# Altium project ST Linux Dev Board.PrjPcb
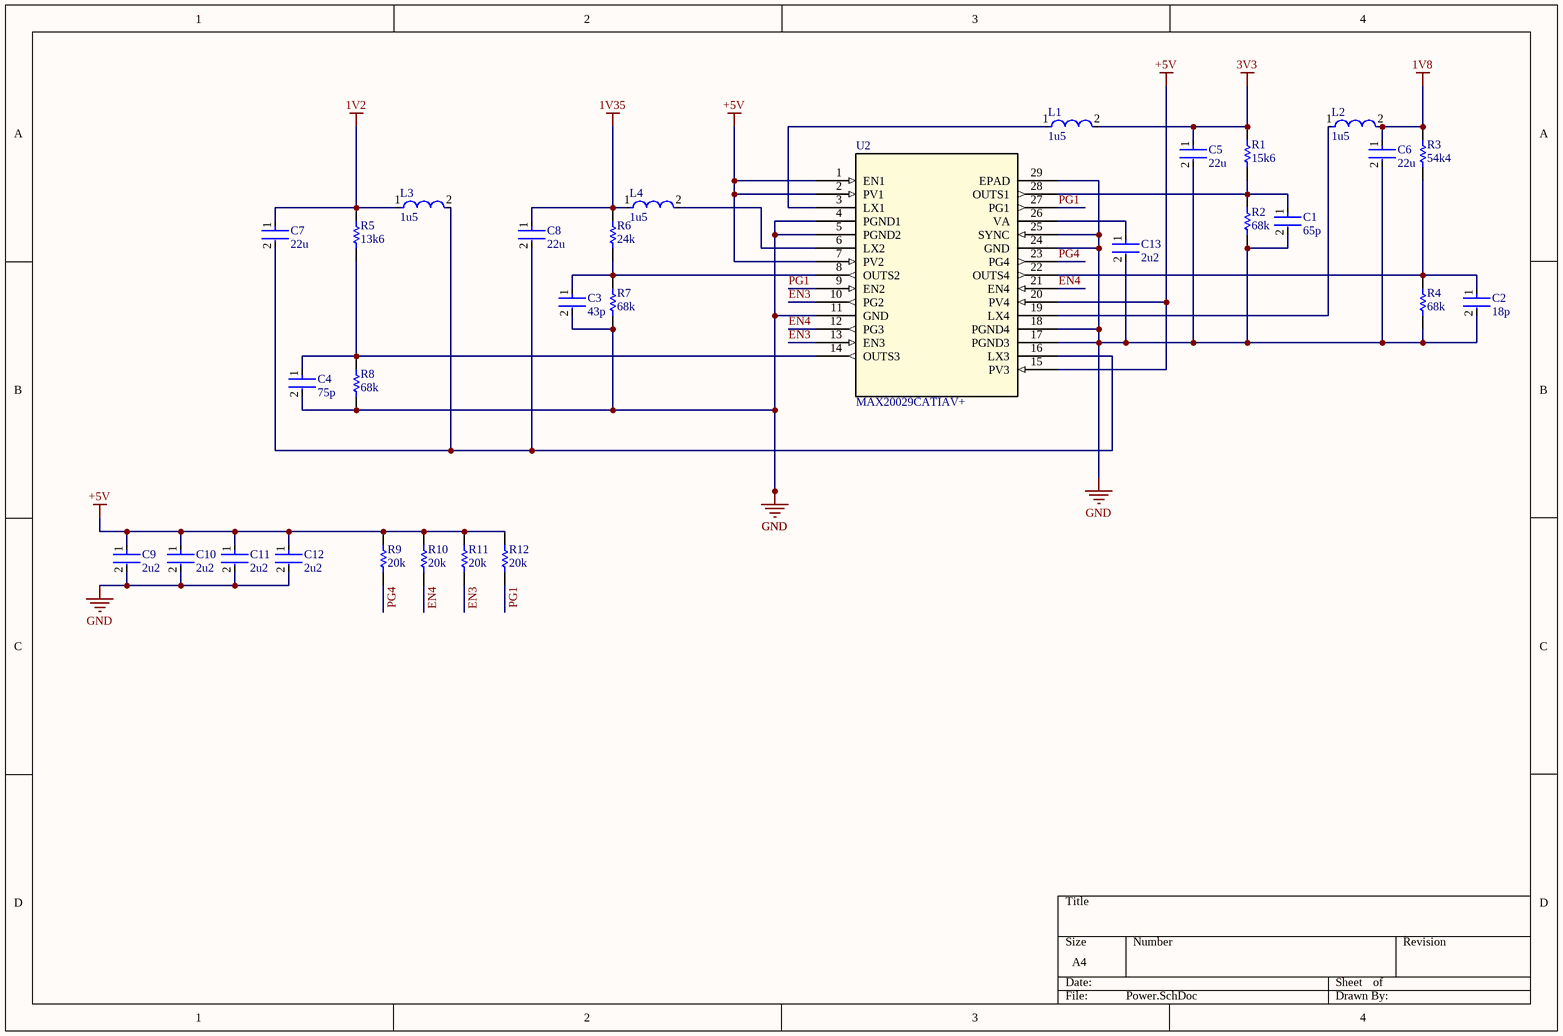
[diagram p0: Power.SchDoc]
7 sheets, 170 parts. Net scope: global (net labels, ports and power ports of the same name join across sheets).
Board file: PCB1.PcbDoc
Sheets:
  Power.SchDoc
  DDR3.SchDoc
  STM32 VDD VSS.SchDoc
  STM32 Decoupling.SchDoc
  MicroSD.SchDoc
  eMMC.SchDoc
  Ethernet.SchDoc

## Sheet Power.SchDoc
size A4; SheetNumber: 1; SheetTotal: 4

### Parts
C1  65p  [FP-C0603C-CF-MFG]
C2  18p  [FP-C0603C-CF-MFG]
C3  43p  [FP-C0603C-CF-MFG]
C4  75p  [FP-C0603C-CF-MFG]
C5  22u  [FP-CC0805-0_85-MFG]
C6  22u  [FP-CC0805-0_85-MFG]
C7  22u  [FP-CC0805-0_85-MFG]
C8  22u  [FP-CC0805-0_85-MFG]
C9  2u2  [FP-CC0805-0_85-MFG]
C10  2u2  [FP-CC0805-0_85-MFG]
C11  2u2  [FP-CC0805-0_85-MFG]
C12  2u2  [FP-CC0805-0_85-MFG]
C13  2u2  [FP-CC0805-0_85-MFG]
L1  1u5  [FP-LQM2HPN_G0-IPC_A]
L2  1u5  [FP-LQM2HPN_G0-IPC_A]
L3  1u5  [FP-LQM2HPN_G0-IPC_A]
L4  1u5  [FP-LQM2HPN_G0-IPC_A]
R1  15k6  [RESC1609X50X30NL8T20]
R2  68k  [RESC1609X50X30NL8T20]
R3  54k4  [RESC1609X50X30NL8T20]
R4  68k  [RESC1609X50X30NL8T20]
R5  13k6  [RESC1609X50X30NL8T20]
R6  24k  [RESC1609X50X30NL8T20]
R7  68k  [RESC1609X50X30NL8T20]
R8  68k  [RESC1609X50X30NL8T20]
R9  20k  [RESC1609X50X30NL8T20]
R10  20k  [RESC1609X50X30NL8T20]
R11  20k  [RESC1609X50X30NL8T20]
R12  20k  [RESC1609X50X30NL8T20]
U2  MAX20029CATIAV+  [QUADBUCK QFN28]

### Nets
1V2: C7.1 L3.1 R5.1
1V8: C6.1 L2.2 R3.1
1V35: C8.1 L4.1 R6.1
3V3: C5.1 L1.2 R1.1
+5V: C9.1 C10.1 C11.1 C12.1 R9.1 R10.1 R11.1 R12.1 U2.1(EN1) U2.2(PV1) U2.7(PV2) U2.15(PV3) U2.20(PV4)
GND: C1.2 C2.2 C3.2 C4.2 C5.2 C6.2 C9.2 C10.2 C11.2 C12.2 C13.2 R2.2 R4.2 R7.2 R8.2 U2.4(PGND1) U2.5(PGND2) U2.11(GND) U2.17(PGND3) U2.18(PGND4) U2.24(GND) U2.25(SYNC) U2.29(EPAD)
EN3: R11.2 U2.10(PG2) U2.13(EN3)
EN4: R10.2 U2.12(PG3) U2.21(EN4)
PG1: R12.2 U2.9(EN2) U2.27(PG1)
PG4: R9.2 U2.23(PG4)
NetC1_1: C1.1 R1.2 R2.1 U2.28(OUTS1)
NetC2_1: C2.1 R3.2 R4.1 U2.22(OUTS4)
NetC3_1: C3.1 R6.2 R7.1 U2.8(OUTS2)
NetC4_1: C4.1 R5.2 R8.1 U2.14(OUTS3)
NetC7_2: C7.2 C8.2 L3.2 U2.16(LX3)
NetC13_1: C13.1 U2.26(VA)
NetL1_1: L1.1 U2.3(LX1)
NetL2_1: L2.1 U2.19(LX4)
NetL4_2: L4.2 U2.6(LX2)

### Library data of the parts
C1-C4 = CMP-2006-03061-2: CAP CER 0.1UF 50V X7R 0603; Manufacturer: KEMET; Manufacturer Part Number: C0603C104K5RACTU; Tolerance: 0.1; Temperature Coefficient: 30ppm/°C; Material: Ceramic; Automotive Grade: Grade 1; Value: 0.10 μF; Temperature: -55°C to +125°C; RoHS: TRUE; Temperature Range High: +125°C; Lead Free: Yes; Octopart: https://octopart.com/c0603c104k5ractu-kemet-139244; Digikey Description: CAP CER 0.1UF 50V X7R 0603; Category: Cap; Package: C0603C-CF; ComponentLink2Description: Datasheet; Temperature Range Low: -55°C; Device Class L1: Passive Components; Voltage Rating: 50 V; Automotive: Yes; Device Class L3: Ceramic Capacitors; ComponentLink2URL: https://api.kemet.com/component-edge/download/datasheet/C0603C100J5GACAUTO.pdf; Capacitance: 0.10 μF; Device Class L2: Capacitors; Temperature Characteristic: X7R; Height: 0.87mm
C5-C13 = CMP-2100-03606-3: CAP CER 0.1UF 50V X7R 0805; Manufacturer Part Number: CC0805KRX7R9BB104; Manufacturer: Yageo; Tolerance: 0.1; Capacitance: 100 nF; Value: 100 nF; Description: CC0805 100 nF X7R 10.00% 50 V; Material: Ceramic; Device Class L1: Passive Components; ComponentLink2Description: Datasheet; Package: CC0805-0.85; Digikey Description: CAP CER 0.1UF 50V X7R 0805; Device Class L3: Ceramic Capacitors; Temperature: -30°C to +85°C; Temperature Characteristic: X7R; Voltage Rating: 50 V; Height: 0.95mm; RoHS: TRUE; Ipc Land Pattern Name: CAPC200125X85; Device Class L2: Capacitors; Category: Cap; Temperature Range Low: -30°C; Temperature Range High: +85°C; Mouser Description: Multilayer Ceramic Capacitors MLCC - SMD/SMT 100nF 50V X7R 10%; Footprint Url: http://www.yageo.com/exep/pages/download/literatures/UPY-C_GEN_24.pdf; Automotive: No; Octopart: https://octopart.com/cc0805krx7r9bb104-yageo-192993; Lead Free: Yes; ComponentLink2URL: http://www.yageo.com/documents/recent/UPY-GPHC_Y5V_6.3V-to-50V_8.pdf
L1-L4 = CMP-06042-016283-1: FIXED IND 1UH 1.6A 55 MOHM SMD; Shielding: Shielded; Tolerance: 20%; Test Frequency: 1MHz; Self Resonant Frequency: 60MHz; Core Material: Ferrite; DC Resistance (DCR): 69mR; Width: 2mm; Length: 2.5mm; Mount: Surface Mount; Packaging: Tape and Reel; Depth: 2.2mm; Height: 1.2mm; Termination: SMD/SMT; Case Code (Metric): 2520; Current Rating: 1.6A; Package Quantity: 3000; Min Operating Temperature: -55°C; Inductance Tolerance: 20%; RoHS Compliant: Yes; Radiation Hardening: No; REACH SVHC: No SVHC; Rated Current-Max: 1.6A; Inductance: 1uH; Series: LQM2HP_G0; Max DC Current: 1.6A; Case Code (Imperial): 1008; Max Operating Temperature: 125°C; DC Current: 1.6A; Military Standard: Not; Case/Package: 1008; Lead Free: Lead Free; Height - Seated (Max): 0.039inch
R1-R12 = CMP-1666-00005-4: Chip Resistor, 10 KOhm, +/- 1%, 100 mW, -55 to 155 degC, 0603 (1608 Metric), RoHS, Tape and Reel; Manufacturer: Vishay Semiconductor; Voltage Rating: 75 V; Max Operating Temperature: 155 degC; PackageDescription: 2-Pin Surface Mount Device, Body 1.575 x 0.85 mm; ComponentLink1Description: Manufacturer URL; RoHSCompliant: true; PackageReference: 0603; REACH SVHC: Unknown; Length: 1.55 mm; DatasheetVersion: 06/2012; Packaging: Tape and Reel; Min Operating Temperature: -55 degC; Mounting Technology: Surface Mount; ComponentLink2URL: https://datasheet.ciiva.com/11809/0900766b80d98afc-11809037.pdf; Height: 0.45 mm; ComponentLink2Description: Datasheet; Package Quantity: 5000; ComponentLink1URL: http://www.vishay.com/
U2 = MAX20029CATIAV+: No Description Available; Mfr_Name: Analog Devices / Maxim Integrated; RefDes: RefDes; Type: Type

## Sheet DDR3.SchDoc
size A4; SheetNumber: 2; SheetTotal: 7
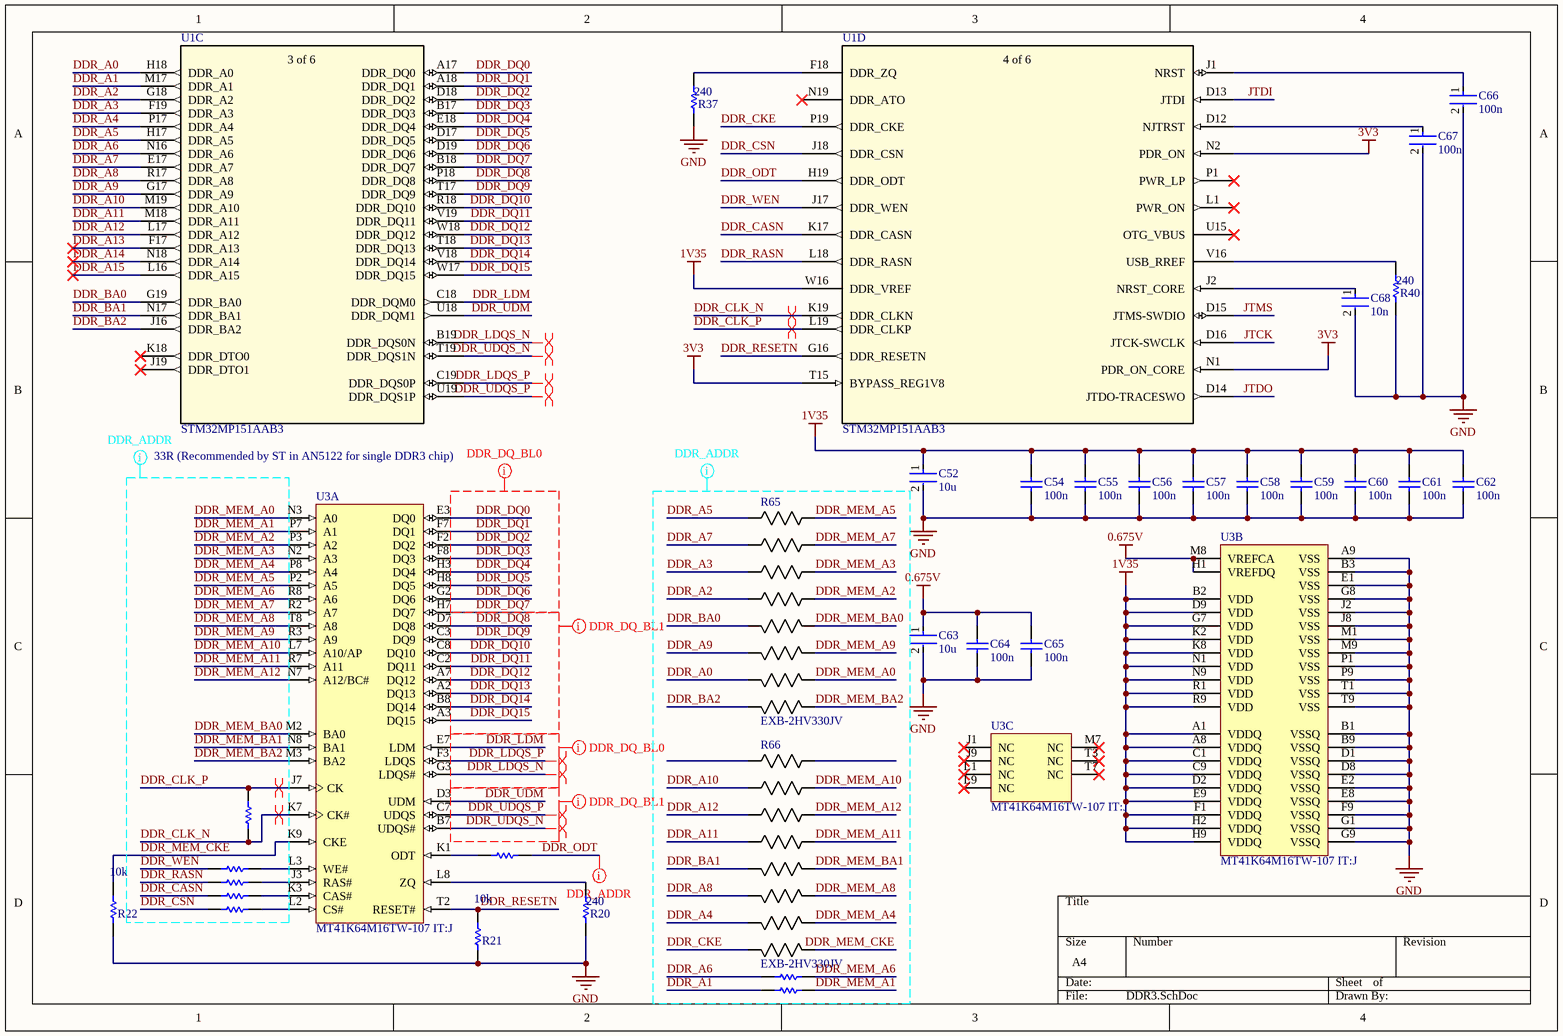
[diagram p1: DDR3.SchDoc]

### Parts
C52  10u  [FP-CC0805-0_85-MFG]
C54  100n  [CAPC0603X33X15LL03T05]
C55  100n  [CAPC0603X33X15LL03T05]
C56  100n  [CAPC0603X33X15LL03T05]
C57  100n  [CAPC0603X33X15LL03T05]
C58  100n  [CAPC0603X33X15LL03T05]
C59  100n  [CAPC0603X33X15LL03T05]
C60  100n  [CAPC0603X33X15LL03T05]
C61  100n  [CAPC0603X33X15LL03T05]
C62  100n  [CAPC0603X33X15LL03T05]
C63  10u  [FP-CC0805-0_85-MFG]
C64  100n  [CAPC0603X33X15LL03T05]
C65  100n  [CAPC0603X33X15LL03T05]
C66  100n  [FP-C0603C-CF-MFG]
C67  100n  [FP-C0603C-CF-MFG]
C68  10n  [FP-C0603C-CF-MFG]
R13  CRCW0201100RFKED  [RESC0603X28X15ML05T05]  (value not drawn)
R14  CRCW0201100RFKED  [RESC0603X28X15ML05T05]  (value not drawn)
R15  CRCW0201100RFKED  [RESC0603X28X15ML05T05]  (value not drawn)
R16  CRCW0201100RFKED  [RESC0603X28X15ML05T05]  (value not drawn)
R17  CRCW0201100RFKED  [RESC0603X28X15ML05T05]  (value not drawn)
R18  CRCW0201100RFKED  [RESC0603X28X15ML05T05]  (value not drawn)
R19  CRCW0201100RFKED  [RESC0603X28X15ML05T05]  (value not drawn)
R20  240  [RESC1609X50X30NL8T20]
R21  10k  [RESC0603X28X15ML05T05]
R22  10k  [RESC0603X28X15ML05T05]
R29  CRCW0201100RFKED  [RESC0603X28X15ML05T05]  (value not drawn)
R37  240  [RESC1609X50X30NL8T20]
R40  240  [RESC1609X50X30NL8T20]
R65  EXB-2HV330JV  [RES_EXB2HV]
R66  EXB-2HV330JV  [RES_EXB2HV]
U1  STM32MP151AAB3  [LFBGA354_16X16_STM]  (parts C,D of 6)
U3  MT41K64M16TW-107 IT:J  [MICT-TW-96]  (parts A,B,C of 3)

### Nets
0.675V: C63.1 C64.2 C65.2 U3.H1(VREFDQ) U3.M8(VREFCA)
1V35: C52.1 C54.2 C55.2 C56.2 C57.2 C58.2 C59.2 C60.2 C61.2 C62.2 U1.W16(DDR_VREF) U3.A1(VDDQ) U3.A8(VDDQ) U3.B2(VDD) U3.C1(VDDQ) U3.C9(VDDQ) U3.D2(VDDQ) U3.D9(VDD) U3.E9(VDDQ) U3.F1(VDDQ) U3.G7(VDD) U3.H2(VDDQ) U3.H9(VDDQ) U3.K2(VDD) U3.K8(VDD) U3.N1(VDD) U3.N9(VDD) U3.R1(VDD) U3.R9(VDD)
3V3: U1.N1(PDR_ON_CORE) U1.N2(PDR_ON) U1.T15(BYPASS_REG1V8)
GND: C52.2 C54.1 C55.1 C56.1 C57.1 C58.1 C59.1 C60.1 C61.1 C62.1 C63.2 C64.1 C65.1 C66.2 C67.2 C68.2 R20.1 R21.1 R22.1 R37.1 R40.1 U3.A9(VSS) U3.B1(VSSQ) U3.B3(VSS) U3.B9(VSSQ) U3.D1(VSSQ) U3.D8(VSSQ) U3.E1(VSS) U3.E2(VSSQ) U3.E8(VSSQ) U3.F9(VSSQ) U3.G1(VSSQ) U3.G8(VSS) U3.G9(VSSQ) U3.J2(VSS) U3.J8(VSS) U3.M1(VSS) U3.M9(VSS) U3.P1(VSS) U3.P9(VSS) U3.T1(VSS) U3.T9(VSS)
DDR_A0: R65.7 U1.H18(DDR_A0)
DDR_A1: R19.1 U1.M17(DDR_A1)
DDR_A2: R65.4 U1.G18(DDR_A2)
DDR_A3: R65.3 U1.F19(DDR_A3)
DDR_A4: R66.7 U1.P17(DDR_A4)
DDR_A5: R65.1 U1.H17(DDR_A5)
DDR_A6: R18.1 U1.N16(DDR_A6)
DDR_A7: R65.2 U1.E17(DDR_A7)
DDR_A8: R66.6 U1.R17(DDR_A8)
DDR_A9: R65.6 U1.G17(DDR_A9)
DDR_A10: R66.2 U1.M19(DDR_A10)
DDR_A11: R66.4 U1.M18(DDR_A11)
DDR_A12: R66.3 U1.L17(DDR_A12)
DDR_A13: U1.F17(DDR_A13)
DDR_A14: U1.N18(DDR_A14)
DDR_A15: U1.L16(DDR_A15)
DDR_BA0: R65.5 U1.G19(DDR_BA0)
DDR_BA1: R66.5 U1.N17(DDR_BA1)
DDR_BA2: R65.8 U1.J16(DDR_BA2)
DDR_CASN: R16.1 U1.K17(DDR_CASN)
DDR_CKE: R66.8 U1.P19(DDR_CKE)
DDR_CLK_N: R29.1 U1.K19(DDR_CLKN) U3.K7(CK#)
DDR_CLK_P: R29.2 U1.L19(DDR_CLKP) U3.J7(CK)
DDR_CSN: R17.1 U1.J18(DDR_CSN)
DDR_DQ0: U1.A17(DDR_DQ0) U3.E3(DQ0)
DDR_DQ1: U1.A18(DDR_DQ1) U3.F7(DQ1)
DDR_DQ2: U1.D18(DDR_DQ2) U3.F2(DQ2)
DDR_DQ3: U1.B17(DDR_DQ3) U3.F8(DQ3)
DDR_DQ4: U1.E18(DDR_DQ4) U3.H3(DQ4)
DDR_DQ5: U1.D17(DDR_DQ5) U3.H8(DQ5)
DDR_DQ6: U1.D19(DDR_DQ6) U3.G2(DQ6)
DDR_DQ7: U1.B18(DDR_DQ7) U3.H7(DQ7)
DDR_DQ8: U1.P18(DDR_DQ8) U3.D7(DQ8)
DDR_DQ9: U1.T17(DDR_DQ9) U3.C3(DQ9)
DDR_DQ10: U1.R18(DDR_DQ10) U3.C8(DQ10)
DDR_DQ11: U1.V19(DDR_DQ11) U3.C2(DQ11)
DDR_DQ12: U1.W18(DDR_DQ12) U3.A7(DQ12)
DDR_DQ13: U1.T18(DDR_DQ13) U3.A2(DQ13)
DDR_DQ14: U1.V18(DDR_DQ14) U3.B8(DQ14)
DDR_DQ15: U1.W17(DDR_DQ15) U3.A3(DQ15)
DDR_LDM: U1.C18(DDR_DQM0) U3.E7(LDM)
DDR_LDQS_N: U1.B19(DDR_DQS0N) U3.G3(LDQS#)
DDR_LDQS_P: U1.C19(DDR_DQS0P) U3.F3(LDQS)
DDR_MEM_A0: R65.10 U3.N3(A0)
DDR_MEM_A1: R19.2 U3.P7(A1)
DDR_MEM_A2: R65.13 U3.P3(A2)
DDR_MEM_A3: R65.14 U3.N2(A3)
DDR_MEM_A4: R66.10 U3.P8(A4)
DDR_MEM_A5: R65.16 U3.P2(A5)
DDR_MEM_A6: R18.2 U3.R8(A6)
DDR_MEM_A7: R65.15 U3.R2(A7)
DDR_MEM_A8: R66.11 U3.T8(A8)
DDR_MEM_A9: R65.11 U3.R3(A9)
DDR_MEM_A10: R66.15 U3.L7(A10/AP)
DDR_MEM_A11: R66.13 U3.R7(A11)
DDR_MEM_A12: R66.14 U3.N7(A12/BC#)
DDR_MEM_BA0: R65.12 U3.M2(BA0)
DDR_MEM_BA1: R66.12 U3.N8(BA1)
DDR_MEM_BA2: R65.9 U3.M3(BA2)
DDR_MEM_CKE: R22.2 R66.9 U3.K9(CKE)
DDR_ODT: R13.2 U1.H19(DDR_ODT)
DDR_RASN: R15.1 U1.L18(DDR_RASN)
DDR_RESETN: R21.2 U1.G16(DDR_RESETN) U3.T2(RESET#)
DDR_UDM: U1.U18(DDR_DQM1) U3.D3(UDM)
DDR_UDQS_N: U1.T19(DDR_DQS1N) U3.B7(UDQS#)
DDR_UDQS_P: U1.U19(DDR_DQS1P) U3.C7(UDQS)
DDR_WEN: R14.1 U1.J17(DDR_WEN)
JTCK: U1.D16(JTCK-SWCLK)
JTDI: U1.D13(JTDI)
JTDO: U1.D14(JTDO-TRACESWO)
JTMS: U1.D15(JTMS-SWDIO)
NetC66_1: C66.1 U1.J1(NRST)
NetC67_1: C67.1 U1.D12(NJTRST)
NetC68_1: C68.1 U1.J2(NRST_CORE)
NetR13_1: R13.1 U3.K1(ODT)
NetR14_2: R14.2 U3.L3(WE#)
NetR15_2: R15.2 U3.J3(RAS#)
NetR16_2: R16.2 U3.K3(CAS#)
NetR17_2: R17.2 U3.L2(CS#)
NetR20_2: R20.2 U3.L8(ZQ)
NetR37_2: R37.2 U1.F18(DDR_ZQ)
NetR40_2: R40.2 U1.V16(USB_RREF)

Not connected (* = marked no-connect by the designer): R66 1 16; U1 J19(DDR_DTO1)* K18(DDR_DTO0)* L1(PWR_ON)* N19(DDR_ATO)* P1(PWR_LP)* U15(OTG_VBUS)*; U3 J1(NC)* J9(NC)* L1(NC)* L9(NC)* M7(NC)* T3(NC)* T7(NC)*

### Layout directives
differential pair: DDR_CLK_N, DDR_CLK_P, DDR_LDQS_N, DDR_LDQS_P, DDR_UDQS_N, DDR_UDQS_P
net class DDR_ADDR: DDR_A0, DDR_A1, DDR_A2, DDR_A3, DDR_A4, DDR_A5, DDR_A6, DDR_A7, DDR_A8, DDR_A9, DDR_A10, DDR_A11, DDR_A12, DDR_BA0, DDR_BA1, DDR_BA2, DDR_CASN, DDR_CKE, DDR_CLK_N, DDR_CLK_P, DDR_CSN, DDR_MEM_A0, DDR_MEM_A1, DDR_MEM_A2, DDR_MEM_A3, DDR_MEM_A4, DDR_MEM_A5, DDR_MEM_A6, DDR_MEM_A7, DDR_MEM_A8, DDR_MEM_A9, DDR_MEM_A10, DDR_MEM_A11, DDR_MEM_A12, DDR_MEM_BA0, DDR_MEM_BA1, DDR_MEM_BA2, DDR_MEM_CKE, DDR_ODT, DDR_RASN, DDR_WEN
net class DDR_DQ_BL0: DDR_DQ0, DDR_DQ1, DDR_DQ2, DDR_DQ3, DDR_DQ4, DDR_DQ5, DDR_DQ6, DDR_DQ7, DDR_LDM, DDR_LDQS_N, DDR_LDQS_P
net class DDR_DQ_BL1: DDR_DQ7, DDR_DQ8, DDR_DQ9, DDR_DQ10, DDR_DQ11, DDR_DQ12, DDR_DQ13, DDR_DQ14, DDR_DQ15, DDR_UDM, DDR_UDQS_N, DDR_UDQS_P

### Notes on the sheet
- 33R (Recommended by ST in AN5122 for single DDR3 chip)
- (in symbol STM32MP151AAB3, part C) 3 of 6
- (in symbol STM32MP151AAB3, part D) 4 of 6

### Library data of the parts
C52 C63 = CMP-2100-03606-3: CAP CER 0.1UF 50V X7R 0805; Manufacturer Part Number: CC0805KRX7R9BB104; Manufacturer: Yageo; Tolerance: 0.1; Capacitance: 100 nF; Value: 100 nF; Material: Ceramic; Device Class L1: Passive Components; ComponentLink2Description: Datasheet; Package: CC0805-0.85; Digikey Description: CAP CER 0.1UF 50V X7R 0805; Device Class L3: Ceramic Capacitors; Temperature: -30°C to +85°C; Temperature Characteristic: X7R; Voltage Rating: 50 V; Height: 0.95mm; RoHS: TRUE; Ipc Land Pattern Name: CAPC200125X85; Device Class L2: Capacitors; Category: Cap; Temperature Range Low: -30°C; Temperature Range High: +85°C; Mouser Description: Multilayer Ceramic Capacitors MLCC - SMD/SMT 100nF 50V X7R 10%; Footprint Url: http://www.yageo.com/exep/pages/download/literatures/UPY-C_GEN_24.pdf; Automotive: No; Octopart: https://octopart.com/cc0805krx7r9bb104-yageo-192993; Lead Free: Yes; ComponentLink2URL: http://www.yageo.com/documents/recent/UPY-GPHC_Y5V_6.3V-to-50V_8.pdf
C54-C62 C64 C65 = CMP-2010-00159-1: Part Number: 02016D104KAT2A; Manufacturer: AVX Interconnect / Elco
C66-C68 = CMP-2006-03061-2: as C1 on sheet Power; Temperature: -55°C to +125°C; RoHS: TRUE; Temperature Range High: +125°C; Lead Free: Yes; Octopart: https://octopart.com/c0603c104k5ractu-kemet-139244; Digikey Description: CAP CER 0.1UF 50V X7R 0603; Category: Cap; Package: C0603C-CF; ComponentLink2Description: Datasheet; Temperature Range Low: -55°C; Device Class L1: Passive Components; Voltage Rating: 50 V; Automotive: Yes; Device Class L3: Ceramic Capacitors; ComponentLink2URL: https://api.kemet.com/component-edge/download/datasheet/C0603C100J5GACAUTO.pdf; Capacitance: 0.10 μF; Device Class L2: Capacitors; Temperature Characteristic: X7R; Height: 0.87mm
R13-R19 R29 = CMP-2004-00005-1: Manufacturer: Vishay; Part Number: CRCW0201100RFKED
R20 R37 R40 = CMP-1666-00005-4: as R1 on sheet Power; Max Operating Temperature: 155 degC; PackageDescription: 2-Pin Surface Mount Device, Body 1.575 x 0.85 mm; ComponentLink1Description: Manufacturer URL; RoHSCompliant: true; PackageReference: 0603; REACH SVHC: Unknown; Length: 1.55 mm; DatasheetVersion: 06/2012; Packaging: Tape and Reel; Min Operating Temperature: -55 degC; Mounting Technology: Surface Mount; ComponentLink2URL: https://datasheet.ciiva.com/11809/0900766b80d98afc-11809037.pdf; Height: 0.45 mm; ComponentLink2Description: Datasheet; Package Quantity: 5000; ComponentLink1URL: http://www.vishay.com/
R21 R22 = CMP-2004-00005-1: Part Number: CRCW0201100RFKED; Manufacturer: Vishay
R65 R66 = EXB-2HV330JV: No Description Available; Mfr_Name: Panasonic
U1 = STM32MP151AAB3: No Description Available; Mfr_Name: STMicroelectronics; RefDes: RefDes; Type: Type
U3 = CMP-2000-06774-1: 1 Gb DDR3L 1866 SDRAM, 64 Mb x 16, 1.07 ns, 1.35 V, -40 to 95 degC, 96-Ball FBGA (TW), RoHS, Tray; Manufacturer: Micron; Density: 1Gb; Screening Level: Industrial; Maximum Clock Rate: 933MHz; Number of Bits per Word: 16Bit; Max Processing Temp: 260; Organization: 64Mx16; Lead Finish: Tin; Address Bus Width: 13Bit; Maximum Operating Current: 63mA; Operating Supply Voltage: 1.35V; Type: DDR3LSDRAM; Mounting Technology: SurfaceMount; Mounting: SurfaceMount; Manufacturer URL: http://www.micron.com/; Number of I/O Lines: 16Bit; Data Bus Width: 16Bit; Datasheet Version: Rev. K, 09/2014; Operating Temperature: -40to95C; Package Description: 96-Ball Fine Pitch Ball Grid Array, Body 8 x 14 mm, Pitch 0.8 mm; Datasheet URL: https://www.micron.com/~/media/documents/products/data-sheet/dram/ddr3/1gb_1_35v_ddr3l.pdf; Package Reference: TW-96

## Sheet STM32 VDD VSS.SchDoc
size A4; SheetNumber: 3; SheetTotal: 4
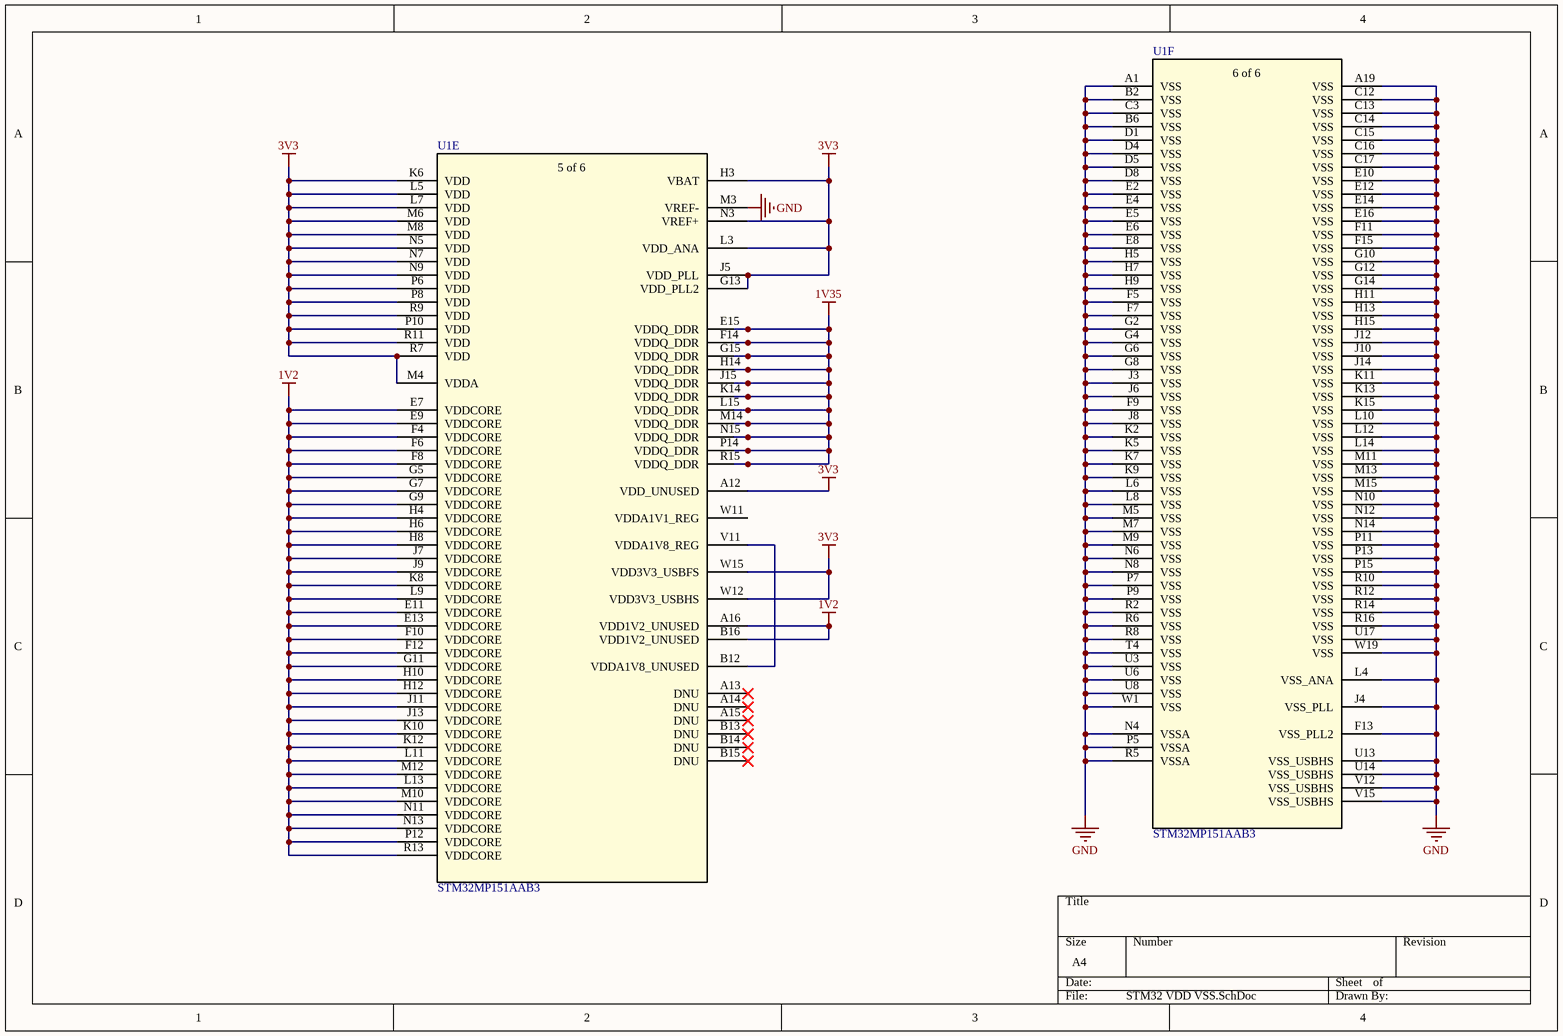
[diagram p2: STM32 VDD VSS.SchDoc]

### Parts
U1  STM32MP151AAB3  [LFBGA354_16X16_STM]  (parts E,F of 6)

### Nets
1V2: U1.A16(VDD1V2_UNUSED) U1.B16(VDD1V2_UNUSED) U1.E7(VDDCORE) U1.E9(VDDCORE) U1.E11(VDDCORE) U1.E13(VDDCORE) U1.F4(VDDCORE) U1.F6(VDDCORE) U1.F8(VDDCORE) U1.F10(VDDCORE) U1.F12(VDDCORE) U1.G5(VDDCORE) U1.G7(VDDCORE) U1.G9(VDDCORE) U1.G11(VDDCORE) U1.H4(VDDCORE) U1.H6(VDDCORE) U1.H8(VDDCORE) U1.H10(VDDCORE) U1.H12(VDDCORE) U1.J7(VDDCORE) U1.J9(VDDCORE) U1.J11(VDDCORE) U1.J13(VDDCORE) U1.K8(VDDCORE) U1.K10(VDDCORE) U1.K12(VDDCORE) U1.L9(VDDCORE) U1.L11(VDDCORE) U1.L13(VDDCORE) U1.M10(VDDCORE) U1.M12(VDDCORE) U1.N11(VDDCORE) U1.N13(VDDCORE) U1.P12(VDDCORE) U1.R13(VDDCORE)
1V35: U1.E15(VDDQ_DDR) U1.F14(VDDQ_DDR) U1.G15(VDDQ_DDR) U1.H14(VDDQ_DDR) U1.J15(VDDQ_DDR) U1.K14(VDDQ_DDR) U1.L15(VDDQ_DDR) U1.M14(VDDQ_DDR) U1.N15(VDDQ_DDR) U1.P14(VDDQ_DDR) U1.R15(VDDQ_DDR)
3V3: U1.A12(VDD_UNUSED) U1.G13(VDD_PLL2) U1.H3(VBAT) U1.J5(VDD_PLL) U1.K6(VDD) U1.L3(VDD_ANA) U1.L5(VDD) U1.L7(VDD) U1.M4(VDDA) U1.M6(VDD) U1.M8(VDD) U1.N3(VREF+) U1.N5(VDD) U1.N7(VDD) U1.N9(VDD) U1.P6(VDD) U1.P8(VDD) U1.P10(VDD) U1.R7(VDD) U1.R9(VDD) U1.R11(VDD) U1.W12(VDD3V3_USBHS) U1.W15(VDD3V3_USBFS)
GND: U1.A1(VSS) U1.A19(VSS) U1.B2(VSS) U1.B6(VSS) U1.C3(VSS) U1.C12(VSS) U1.C13(VSS) U1.C14(VSS) U1.C15(VSS) U1.C16(VSS) U1.C17(VSS) U1.D1(VSS) U1.D4(VSS) U1.D5(VSS) U1.D8(VSS) U1.E2(VSS) U1.E4(VSS) U1.E5(VSS) U1.E6(VSS) U1.E8(VSS) U1.E10(VSS) U1.E12(VSS) U1.E14(VSS) U1.E16(VSS) U1.F5(VSS) U1.F7(VSS) U1.F9(VSS) U1.F11(VSS) U1.F13(VSS_PLL2) U1.F15(VSS) U1.G2(VSS) U1.G4(VSS) U1.G6(VSS) U1.G8(VSS) U1.G10(VSS) U1.G12(VSS) U1.G14(VSS) U1.H5(VSS) U1.H7(VSS) U1.H9(VSS) U1.H11(VSS) U1.H13(VSS) U1.H15(VSS) U1.J3(VSS) U1.J4(VSS_PLL) U1.J6(VSS) U1.J8(VSS) U1.J10(VSS) U1.J12(VSS) U1.J14(VSS) U1.K2(VSS) U1.K5(VSS) U1.K7(VSS) U1.K9(VSS) U1.K11(VSS) U1.K13(VSS) U1.K15(VSS) U1.L4(VSS_ANA) U1.L6(VSS) U1.L8(VSS) U1.L10(VSS) U1.L12(VSS) U1.L14(VSS) U1.M3(VREF-) U1.M5(VSS) U1.M7(VSS) U1.M9(VSS) U1.M11(VSS) U1.M13(VSS) U1.M15(VSS) U1.N4(VSSA) U1.N6(VSS) U1.N8(VSS) U1.N10(VSS) U1.N12(VSS) U1.N14(VSS) U1.P5(VSSA) U1.P7(VSS) U1.P9(VSS) U1.P11(VSS) U1.P13(VSS) U1.P15(VSS) U1.R2(VSS) U1.R5(VSSA) U1.R6(VSS) U1.R8(VSS) U1.R10(VSS) U1.R12(VSS) U1.R14(VSS) U1.R16(VSS) U1.T4(VSS) U1.U3(VSS) U1.U6(VSS) U1.U8(VSS) U1.U13(VSS_USBHS) U1.U14(VSS_USBHS) U1.U17(VSS) U1.V12(VSS_USBHS) U1.V15(VSS_USBHS) U1.W1(VSS) U1.W19(VSS)
NetU1_B12: U1.B12(VDDA1V8_UNUSED) U1.V11(VDDA1V8_REG)

Not connected (* = marked no-connect by the designer): U1 A13(DNU)* A14(DNU)* A15(DNU)* B13(DNU)* B14(DNU)* B15(DNU)* W11(VDDA1V1_REG)

### Notes on the sheet
- (in symbol STM32MP151AAB3, part E) 5 of 6
- (in symbol STM32MP151AAB3, part F) 6 of 6

### Library data of the parts
U1 = STM32MP151AAB3: as U1 on sheet DDR3; RefDes: RefDes; Type: Type

## Sheet STM32 Decoupling.SchDoc
size A4; SheetNumber: 4; SheetTotal: 7
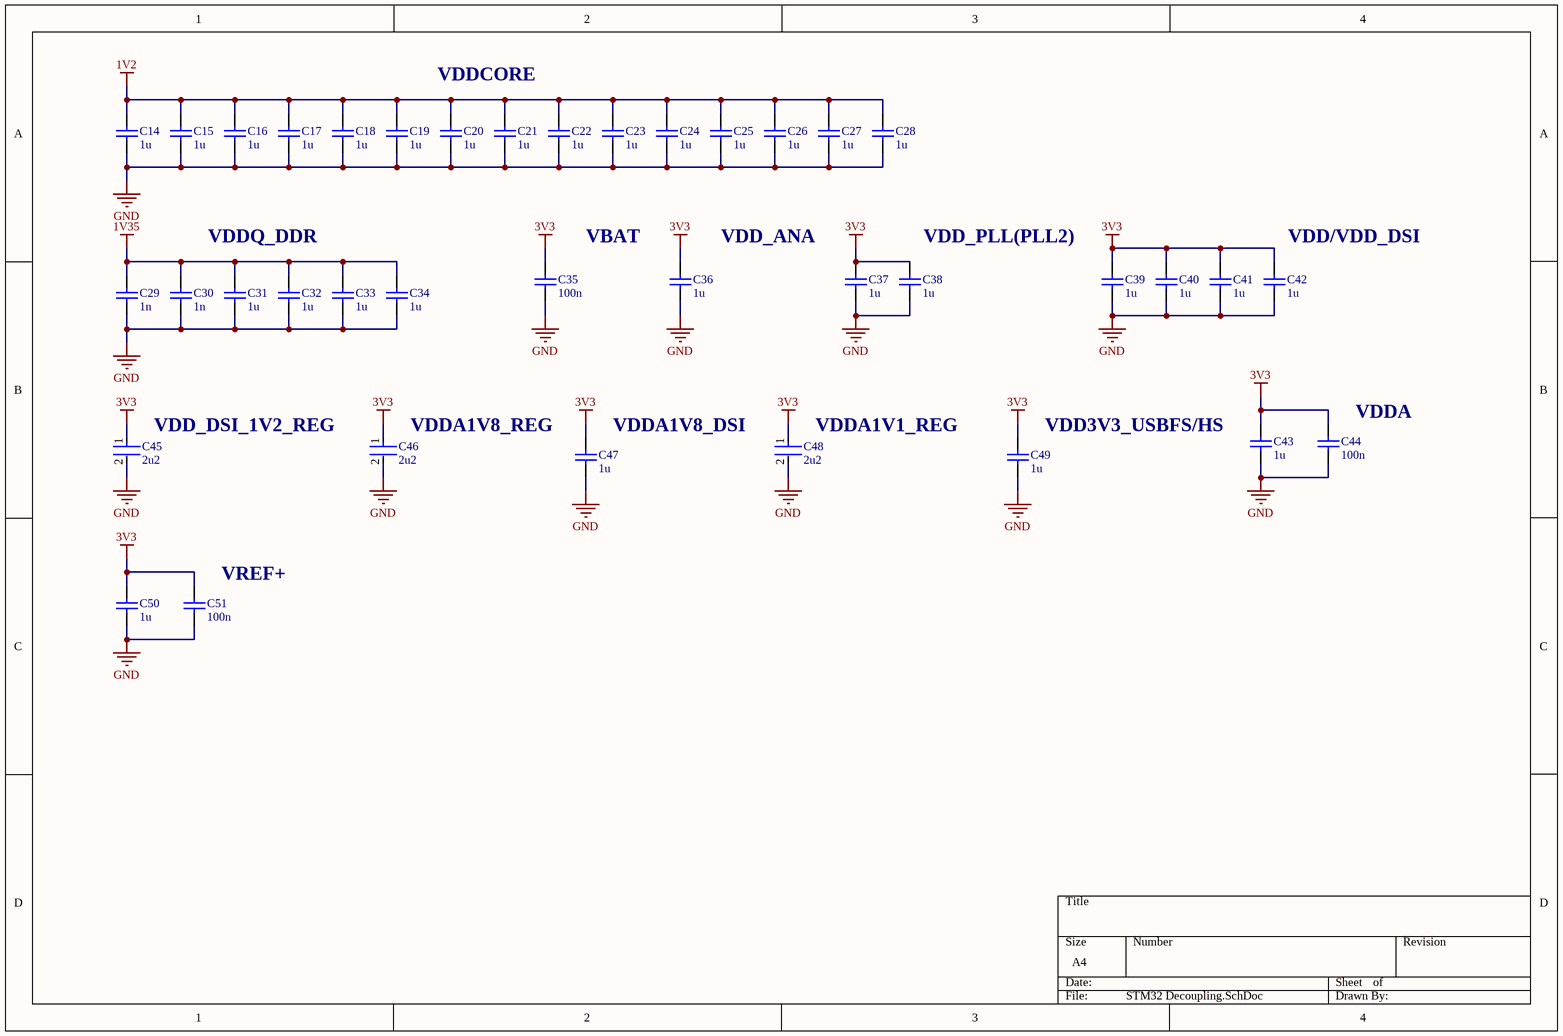
[diagram p3: STM32 Decoupling.SchDoc]

### Parts
C14  1u  [CAPC0603X33X15LL03T05]
C15  1u  [CAPC0603X33X15LL03T05]
C16  1u  [CAPC0603X33X15LL03T05]
C17  1u  [CAPC0603X33X15LL03T05]
C18  1u  [CAPC0603X33X15LL03T05]
C19  1u  [CAPC0603X33X15LL03T05]
C20  1u  [CAPC0603X33X15LL03T05]
C21  1u  [CAPC0603X33X15LL03T05]
C22  1u  [CAPC0603X33X15LL03T05]
C23  1u  [CAPC0603X33X15LL03T05]
C24  1u  [CAPC0603X33X15LL03T05]
C25  1u  [CAPC0603X33X15LL03T05]
C26  1u  [CAPC0603X33X15LL03T05]
C27  1u  [CAPC0603X33X15LL03T05]
C28  1u  [CAPC0603X33X15LL03T05]
C29  1n  [CAPC0603X33X15LL03T05]
C30  1n  [CAPC0603X33X15LL03T05]
C31  1u  [CAPC0603X33X15LL03T05]
C32  1u  [CAPC0603X33X15LL03T05]
C33  1u  [CAPC0603X33X15LL03T05]
C34  1u  [CAPC0603X33X15LL03T05]
C35  100n  [CAPC0603X33X15LL03T05]
C36  1u  [CAPC0603X33X15LL03T05]
C37  1u  [CAPC0603X33X15LL03T05]
C38  1u  [CAPC0603X33X15LL03T05]
C39  1u  [CAPC0603X33X15LL03T05]
C40  1u  [CAPC0603X33X15LL03T05]
C41  1u  [CAPC0603X33X15LL03T05]
C42  1u  [CAPC0603X33X15LL03T05]
C43  1u  [CAPC0603X33X15LL03T05]
C44  100n  [CAPC0603X33X15LL03T05]
C45  2u2  [FP-C0603C-CF-MFG]
C46  2u2  [FP-C0603C-CF-MFG]
C47  1u  [CAPC0603X33X15LL03T05]
C48  2u2  [FP-C0603C-CF-MFG]
C49  1u  [CAPC0603X33X15LL03T05]
C50  1u  [CAPC0603X33X15LL03T05]
C51  100n  [CAPC0603X33X15LL03T05]

### Nets
1V2: C14.2 C15.2 C16.2 C17.2 C18.2 C19.2 C20.2 C21.2 C22.2 C23.2 C24.2 C25.2 C26.2 C27.2 C28.2
1V35: C29.2 C30.2 C31.2 C32.2 C33.2 C34.2
3V3: C35.2 C36.2 C37.2 C38.2 C39.2 C40.2 C41.2 C42.2 C43.2 C44.2 C45.1 C46.1 C47.2 C48.1 C49.2 C50.2 C51.2
GND: C14.1 C15.1 C16.1 C17.1 C18.1 C19.1 C20.1 C21.1 C22.1 C23.1 C24.1 C25.1 C26.1 C27.1 C28.1 C29.1 C30.1 C31.1 C32.1 C33.1 C34.1 C35.1 C36.1 C37.1 C38.1 C39.1 C40.1 C41.1 C42.1 C43.1 C44.1 C45.2 C46.2 C47.1 C48.2 C49.1 C50.1 C51.1

### Notes on the sheet
- VDDCORE
- VDDQ_DDR
- VBAT
- VDD_ANA
- (near C38) VDD_PLL(PLL2)
- (near C42) VDD/VDD_DSI
- (near C45) VDD_DSI_1V2_REG
- (near C46) VDDA1V8_REG
- (near C47) VDDA1V8_DSI
- (near C48) VDDA1V1_REG
- (near C49) VDD3V3_USBFS/HS
- (near C44) VDDA
- (near C51) VREF+

### Library data of the parts
C14-C44 C47 C49-C51 = CMP-2010-00159-1: as C54 on sheet DDR3
C45 C46 C48 = CMP-2006-03061-2: as C1 on sheet Power; Temperature: -55°C to +125°C; RoHS: TRUE; Temperature Range High: +125°C; Lead Free: Yes; Octopart: https://octopart.com/c0603c104k5ractu-kemet-139244; Digikey Description: CAP CER 0.1UF 50V X7R 0603; Category: Cap; Package: C0603C-CF; ComponentLink2Description: Datasheet; Temperature Range Low: -55°C; Device Class L1: Passive Components; Voltage Rating: 50 V; Automotive: Yes; Device Class L3: Ceramic Capacitors; ComponentLink2URL: https://api.kemet.com/component-edge/download/datasheet/C0603C100J5GACAUTO.pdf; Capacitance: 0.10 μF; Device Class L2: Capacitors; Temperature Characteristic: X7R; Height: 0.87mm

## Sheet MicroSD.SchDoc
size A4; SheetNumber: 5; SheetTotal: 7
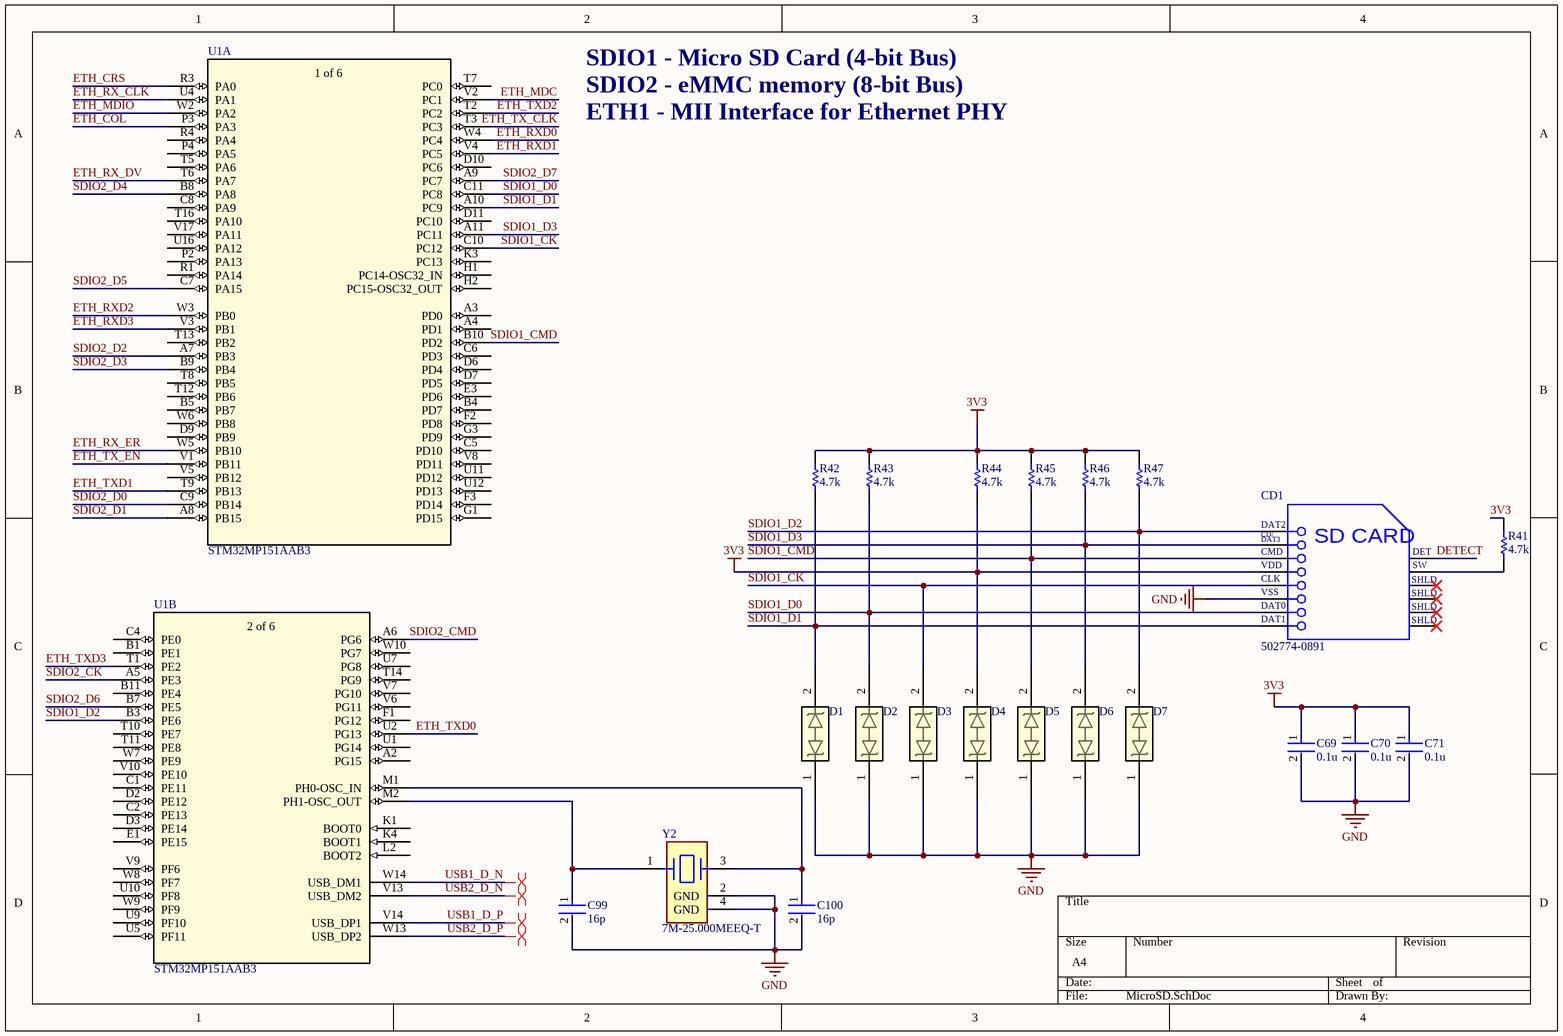
[diagram p4: MicroSD.SchDoc]

### Parts
C69  0.1u  [FP-C0603C-CF-MFG]
C70  0.1u  [FP-C0603C-CF-MFG]
C71  0.1u  [FP-C0603C-CF-MFG]
C99  16p  [FP-C0603C-CF-MFG]
C100  16p  [FP-C0603C-CF-MFG]
CD1  502774-0891  [MOLX-502774-0891_V]
D1  DESD5V0U1BA-7  [SOD-323]  (value not drawn)
D2  DESD5V0U1BA-7  [SOD-323]  (value not drawn)
D3  DESD5V0U1BA-7  [SOD-323]  (value not drawn)
D4  DESD5V0U1BA-7  [SOD-323]  (value not drawn)
D5  DESD5V0U1BA-7  [SOD-323]  (value not drawn)
D6  DESD5V0U1BA-7  [SOD-323]  (value not drawn)
D7  DESD5V0U1BA-7  [SOD-323]  (value not drawn)
R41  4.7k  [RESC1609X50X30NL8T20]
R42  4.7k  [RESC1609X50X30NL8T20]
R43  4.7k  [RESC1609X50X30NL8T20]
R44  4.7k  [RESC1609X50X30NL8T20]
R45  4.7k  [RESC1609X50X30NL8T20]
R46  4.7k  [RESC1609X50X30NL8T20]
R47  4.7k  [RESC1609X50X30NL8T20]
U1  STM32MP151AAB3  [LFBGA354_16X16_STM]  (parts A,B of 6)
Y2  7M-25.000MEEQ-T  [FP-7M-MFG]

### Nets
3V3: C69.1 C70.1 C71.1 CD1.4(VDD) D4.2 R41.2 R42.2 R43.2 R44.1 R44.2 R45.2 R46.2 R47.2
GND: C69.2 C70.2 C71.2 C99.2 C100.2 CD1.6(VSS) D1.1 D2.1 D3.1 D4.1 D5.1 D6.1 D7.1 Y2.2(GND) Y2.4(GND)
DETECT: CD1.9(DETECT)
ETH_COL: U1.P3(PA3)
ETH_CRS: U1.R3(PA0)
ETH_MDC: U1.V2(PC1)
ETH_MDIO: U1.W2(PA2)
ETH_RX_CLK: U1.U4(PA1)
ETH_RX_DV: U1.T6(PA7)
ETH_RX_ER: U1.W5(PB10)
ETH_RXD0: U1.W4(PC4)
ETH_RXD1: U1.V4(PC5)
ETH_RXD2: U1.W3(PB0)
ETH_RXD3: U1.V3(PB1)
ETH_TX_CLK: U1.T3(PC3)
ETH_TX_EN: U1.V1(PB11)
ETH_TXD0: U1.U2(PG13)
ETH_TXD1: U1.T9(PB13)
ETH_TXD2: U1.T2(PC2)
ETH_TXD3: U1.T1(PE2)
SDIO1_CK: CD1.5(CLK) D3.2 U1.C10(PC12)
SDIO1_CMD: CD1.3(CMD) D5.2 R45.1 U1.B10(PD2)
SDIO1_D0: CD1.7(DAT0) D2.2 R43.1 U1.C11(PC8)
SDIO1_D1: CD1.8(DAT1) D1.2 R42.1 U1.A10(PC9)
SDIO1_D2: CD1.1(DAT2) D7.2 R47.1 U1.B3(PE6)
SDIO1_D3: CD1.2(CD/DAT3) D6.2 R46.1 U1.A11(PC11)
SDIO2_CK: U1.A5(PE3)
SDIO2_CMD: U1.A6(PG6)
SDIO2_D0: U1.C9(PB14)
SDIO2_D1: U1.A8(PB15)
SDIO2_D2: U1.A7(PB3)
SDIO2_D3: U1.B9(PB4)
SDIO2_D4: U1.B8(PA8)
SDIO2_D5: U1.C7(PA15)
SDIO2_D6: U1.B7(PE5)
SDIO2_D7: U1.A9(PC7)
USB1_D_N: U1.W14(USB_DM1)
USB1_D_P: U1.V14(USB_DP1)
USB2_D_N: U1.V13(USB_DM2)
USB2_D_P: U1.W13(USB_DP2)
NetC99_1: C99.1 U1.M2(PH1-OSC_OUT) Y2.1
NetC100_1: C100.1 U1.M1(PH0-OSC_IN) Y2.3
NetCD1_10: CD1.10(SWITCH) R41.1

Not connected (* = marked no-connect by the designer): CD1 11(SHLD)* 12(SHLD)* 13(SHLD)* 14(SHLD)*; U1 A2(PG15) A3(PD0) A4(PD1) B1(PE1) B4(PD7) B5(PB7) B11(PE4) C1(PE11) C2(PE13) C4(PE0) C5(PD10) C6(PD3) C8(PA9) D2(PE12) D3(PE14) D6(PD4) D7(PD5) D9(PB9) D10(PC6) D11(PC10) E1(PE15) E3(PD6) F1(PG12) F2(PD8) F3(PD14) G1(PD15) G3(PD9) H1(PC14-OSC32_IN) H2(PC15-OSC32_OUT) K1(BOOT0) K3(PC13) K4(BOOT1) L2(BOOT2) P2(PA13) P4(PA5) R1(PA14) R4(PA4) T5(PA6) T7(PC0) T8(PB5) T10(PE7) T11(PE8) T12(PB6) T13(PB2) T14(PG9) T16(PA10) U1(PG14) U5(PF11) U7(PG8) U9(PF10) U10(PF8) U11(PD12) U12(PD13) U16(PA12) V5(PB12) V6(PG11) V7(PG10) V8(PD11) V9(PF6) V10(PE10) V17(PA11) W6(PB8) W7(PE9) W8(PF7) W9(PF9) W10(PG7)

### Layout directives
differential pair: USB1_D_N, USB1_D_P, USB2_D_N, USB2_D_P

### Notes on the sheet
- SDIO1 - Micro SD Card (4-bit Bus)
- SDIO2 - eMMC memory (8-bit Bus)
- ETH1 - MII Interface for Ethernet PHY
- (in symbol CMP-2000-05248-1) CD/; DAT3; SD CARD; DET; SW
- (in symbol STM32MP151AAB3, part A) 1 of 6
- (in symbol STM32MP151AAB3, part B) 2 of 6

### Library data of the parts
C69-C71 C99 C100 = CMP-2006-03061-2: as C1 on sheet Power; Temperature: -55°C to +125°C; RoHS: TRUE; Temperature Range High: +125°C; Lead Free: Yes; Octopart: https://octopart.com/c0603c104k5ractu-kemet-139244; Digikey Description: CAP CER 0.1UF 50V X7R 0603; Category: Cap; Package: C0603C-CF; ComponentLink2Description: Datasheet; Temperature Range Low: -55°C; Device Class L1: Passive Components; Voltage Rating: 50 V; Automotive: Yes; Device Class L3: Ceramic Capacitors; ComponentLink2URL: https://api.kemet.com/component-edge/download/datasheet/C0603C100J5GACAUTO.pdf; Capacitance: 0.10 μF; Device Class L2: Capacitors; Temperature Characteristic: X7R; Height: 0.87mm
CD1 = CMP-2000-05248-1: Micro SD Memory Card Connector, 0.5 A, 10 V (DC), -25 to 85 degC, 8-Pin SMT, RoHS, Tape and Reel; Manufacturer: Molex; 3D Model: 502774-0891.stp; Online Catalog: microSD™Series; Number of Positions: 10(8+2); Card Type: SecureDigital-microSD™; Insertion, Removal Method: PushIn,PushOut; Other Names: WM24066DKR; Connector Type: ConnectorandEjector; Features: Switch; Family: MemoryConnectors-PCCardSockets; Manufacturer URL: http://www.molex.com/; Mounting Type: SurfaceMount,RightAngle; Contact Finish Thickness: 20µin(0.51µm); Standard Package: 1; Series: 502774; Ejector Side: -; Datasheet Version: Rev. D, 04/2004; Category: Connectors,Interconnects; Contact Finish: Gold; Datasheet URL: https://datasheet.ciiva.com/1104/1499551-1104671.pdf; RoHS Information: 502774-0891CertofCompliance; Mounting Feature: Reverse-Bottom; Packaging: Digi-Reel; Height Above Board: 0.071"(1.80mm); Catalog Drawings: 502774-0891
D1-D7 = DESD5V0U1BA-7: No Description Available; Mfr_Name: Diodes Inc; Type: DEV; Copyright: Copyright (C) 2023 Ultra Librarian. All rights reserved.; Manufacturer_Part_Number: DESD5V0U1BA-7; RefDes: RefDes
R41-R47 = CMP-1666-00005-4: as R1 on sheet Power; Max Operating Temperature: 155 degC; PackageDescription: 2-Pin Surface Mount Device, Body 1.575 x 0.85 mm; ComponentLink1Description: Manufacturer URL; RoHSCompliant: true; PackageReference: 0603; REACH SVHC: Unknown; Length: 1.55 mm; DatasheetVersion: 06/2012; Packaging: Tape and Reel; Min Operating Temperature: -55 degC; Mounting Technology: Surface Mount; ComponentLink2URL: https://datasheet.ciiva.com/11809/0900766b80d98afc-11809037.pdf; Height: 0.45 mm; ComponentLink2Description: Datasheet; Package Quantity: 5000; ComponentLink1URL: http://www.vishay.com/
U1 = STM32MP151AAB3: as U1 on sheet DDR3; RefDes: RefDes; Type: Type
Y2 = CMP-18717-000310-1: Crystal 25MHz, 10ppm, 10pF, 50Ω; ESR (Equivalent Series Resistance): 60R; Package Quantity: 3000; Frequency: 25MHz; Width: 0.098inch; Depth: 2.5mm; Series: 7M; Case/Package: SMD/SMT; Min Operating Temperature: -20°C; Frequency Stability: 10ppm; Termination: SMD/SMT; Max Operating Temperature: 70°C; REACH SVHC: No SVHC; Length: 3.2mm; Number of Pins: 4; Frequency Tolerance: 10ppm; Mount: Surface Mount; Tolerance: 10ppm; Height: 0.031inch; Load Capacitance: 10pF; Packaging: Tape and Reel

## Sheet eMMC.SchDoc
size A4; SheetNumber: 6; SheetTotal: 6
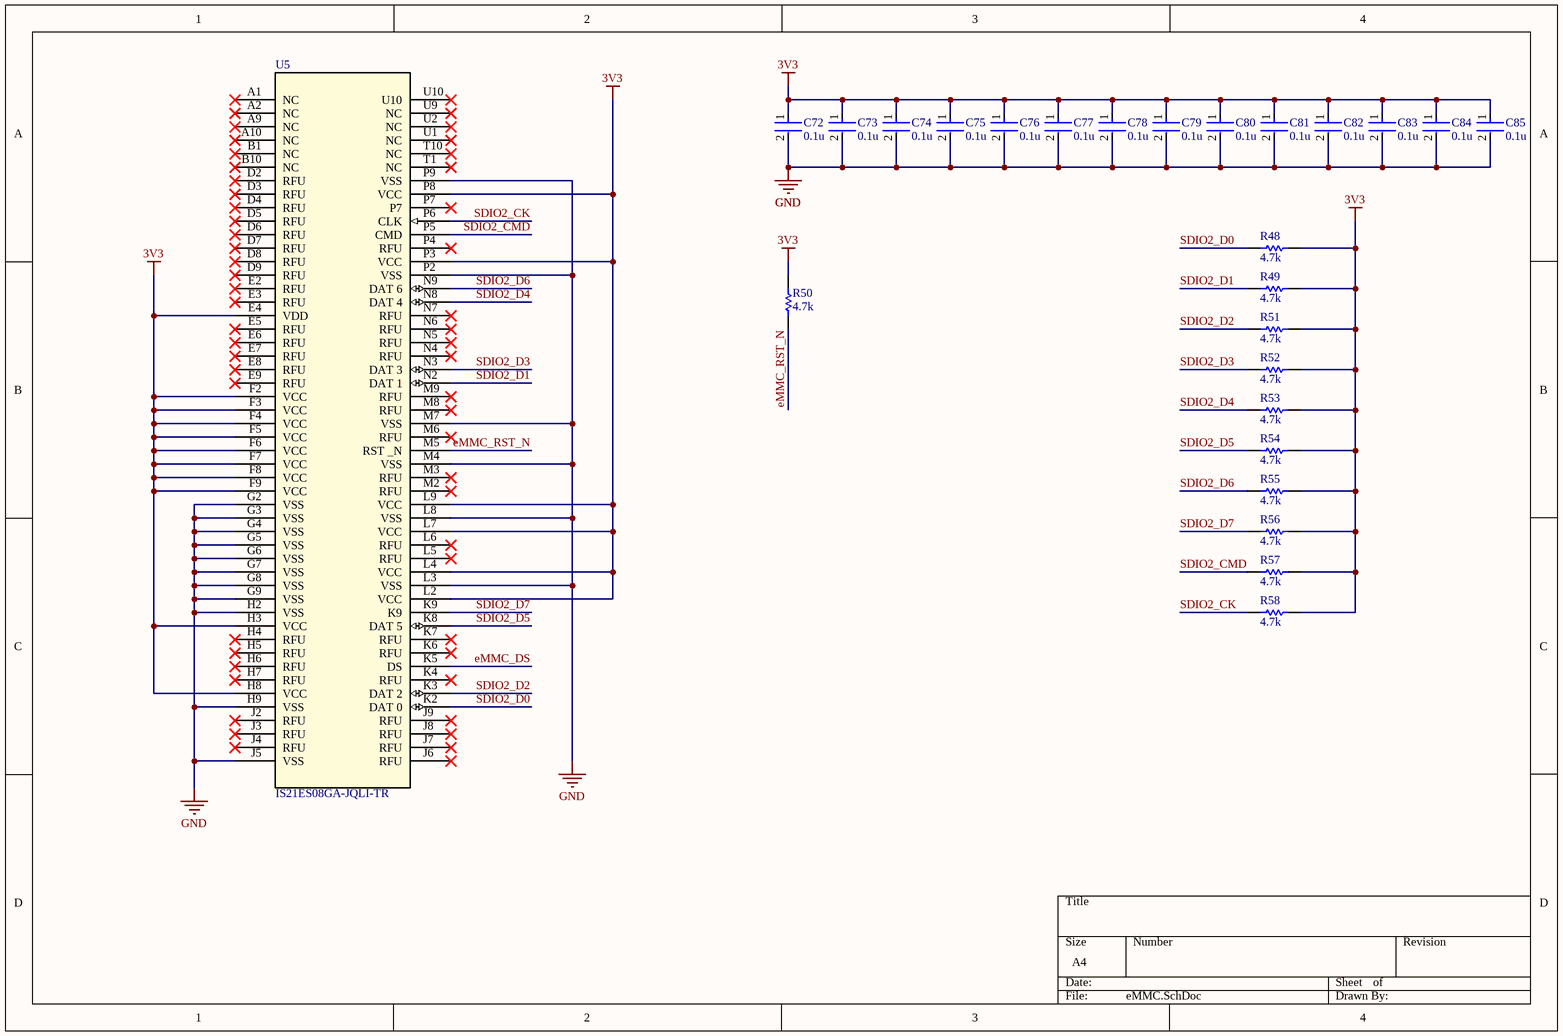
[diagram p5: eMMC.SchDoc]

### Parts
C72  0.1u  [FP-C0603C-CF-MFG]
C73  0.1u  [FP-C0603C-CF-MFG]
C74  0.1u  [FP-C0603C-CF-MFG]
C75  0.1u  [FP-C0603C-CF-MFG]
C76  0.1u  [FP-C0603C-CF-MFG]
C77  0.1u  [FP-C0603C-CF-MFG]
C78  0.1u  [FP-C0603C-CF-MFG]
C79  0.1u  [FP-C0603C-CF-MFG]
C80  0.1u  [FP-C0603C-CF-MFG]
C81  0.1u  [FP-C0603C-CF-MFG]
C82  0.1u  [FP-C0603C-CF-MFG]
C83  0.1u  [FP-C0603C-CF-MFG]
C84  0.1u  [FP-C0603C-CF-MFG]
C85  0.1u  [FP-C0603C-CF-MFG]
R48  4.7k  [RESC1609X50X30NL8T20]
R49  4.7k  [RESC1609X50X30NL8T20]
R50  4.7k  [RESC1609X50X30NL8T20]
R51  4.7k  [RESC1609X50X30NL8T20]
R52  4.7k  [RESC1609X50X30NL8T20]
R53  4.7k  [RESC1609X50X30NL8T20]
R54  4.7k  [RESC1609X50X30NL8T20]
R55  4.7k  [RESC1609X50X30NL8T20]
R56  4.7k  [RESC1609X50X30NL8T20]
R57  4.7k  [RESC1609X50X30NL8T20]
R58  4.7k  [RESC1609X50X30NL8T20]
U5  IS21ES08GA-JQLI-TR  [FBGA100_ISI]

### Nets
3V3: C72.1 C73.1 C74.1 C75.1 C76.1 C77.1 C78.1 C79.1 C80.1 C81.1 C82.1 C83.1 C84.1 C85.1 R48.1 R49.1 R50.2 R51.1 R52.1 R53.1 R54.1 R55.1 R56.1 R57.1 R58.1 U5.E4(VDD) U5.F2(VCC) U5.F3(VCC) U5.F4(VCC) U5.F5(VCC) U5.F6(VCC) U5.F7(VCC) U5.F8(VCC) U5.F9(VCC) U5.H3(VCC) U5.H8(VCC) U5.L2(VCC) U5.L4(VCC) U5.L7(VCC) U5.L9(VCC) U5.P3(VCC) U5.P8(VCC)
GND: C72.2 C73.2 C74.2 C75.2 C76.2 C77.2 C78.2 C79.2 C80.2 C81.2 C82.2 C83.2 C84.2 C85.2 U5.G2(VSS) U5.G3(VSS) U5.G4(VSS) U5.G5(VSS) U5.G6(VSS) U5.G7(VSS) U5.G8(VSS) U5.G9(VSS) U5.H2(VSS) U5.H9(VSS) U5.J5(VSS) U5.L3(VSS) U5.L8(VSS) U5.M4(VSS) U5.M7(VSS) U5.P2(VSS) U5.P9(VSS)
eMMC_DS: U5.K5(DS)
eMMC_RST_N: R50.1 U5.M5(RST__N)
SDIO2_CK: R58.2 U5.P6(CLK)
SDIO2_CMD: R57.2 U5.P5(CMD)
SDIO2_D0: R48.2 U5.K2(DAT_0)
SDIO2_D1: R49.2 U5.N2(DAT_1)
SDIO2_D2: R51.2 U5.K3(DAT_2)
SDIO2_D3: R52.2 U5.N3(DAT_3)
SDIO2_D4: R53.2 U5.N8(DAT_4)
SDIO2_D5: R54.2 U5.K8(DAT_5)
SDIO2_D6: R55.2 U5.N9(DAT_6)
SDIO2_D7: R56.2 U5.K9

Not connected (* = marked no-connect by the designer): U5 A1(NC)* A2(NC)* A9(NC)* A10(NC)* B1(NC)* B10(NC)* D2(RFU)* D3(RFU)* D4(RFU)* D5(RFU)* D6(RFU)* D7(RFU)* D8(RFU)* D9(RFU)* E2(RFU)* E3(RFU)* E5(RFU)* E6(RFU)* E7(RFU)* E8(RFU)* E9(RFU)* H4(RFU)* H5(RFU)* H6(RFU)* H7(RFU)* J2(RFU)* J3(RFU)* J4(RFU)* J6(RFU)* J7(RFU)* J8(RFU)* J9(RFU)* K4(RFU)* K6(RFU)* K7(RFU)* L5(RFU)* L6(RFU)* M2(RFU)* M3(RFU)* M6(RFU)* M8(RFU)* M9(RFU)* N4(RFU)* N5(RFU)* N6(RFU)* N7(RFU)* P4(RFU)* P7* T1(NC)* T10(NC)* U1(NC)* U2(NC)* U9(NC)* U10*

### Library data of the parts
C72-C85 = CMP-2006-03061-2: as C1 on sheet Power; Temperature: -55°C to +125°C; RoHS: TRUE; Temperature Range High: +125°C; Lead Free: Yes; Octopart: https://octopart.com/c0603c104k5ractu-kemet-139244; Digikey Description: CAP CER 0.1UF 50V X7R 0603; Category: Cap; Package: C0603C-CF; ComponentLink2Description: Datasheet; Temperature Range Low: -55°C; Device Class L1: Passive Components; Voltage Rating: 50 V; Automotive: Yes; Device Class L3: Ceramic Capacitors; ComponentLink2URL: https://api.kemet.com/component-edge/download/datasheet/C0603C100J5GACAUTO.pdf; Capacitance: 0.10 μF; Device Class L2: Capacitors; Temperature Characteristic: X7R; Height: 0.87mm
R48-R58 = CMP-1666-00005-4: as R1 on sheet Power; Max Operating Temperature: 155 degC; PackageDescription: 2-Pin Surface Mount Device, Body 1.575 x 0.85 mm; ComponentLink1Description: Manufacturer URL; RoHSCompliant: true; PackageReference: 0603; REACH SVHC: Unknown; Length: 1.55 mm; DatasheetVersion: 06/2012; Packaging: Tape and Reel; Min Operating Temperature: -55 degC; Mounting Technology: Surface Mount; ComponentLink2URL: https://datasheet.ciiva.com/11809/0900766b80d98afc-11809037.pdf; Height: 0.45 mm; ComponentLink2Description: Datasheet; Package Quantity: 5000; ComponentLink1URL: http://www.vishay.com/
U5 = IS21ES08GA-JQLI-TR: No Description Available; Mfr_Name: ISSI; Type: Memory; RefDes: RefDes

## Sheet Ethernet.SchDoc
size A4; SheetNumber: 7; SheetTotal: 7
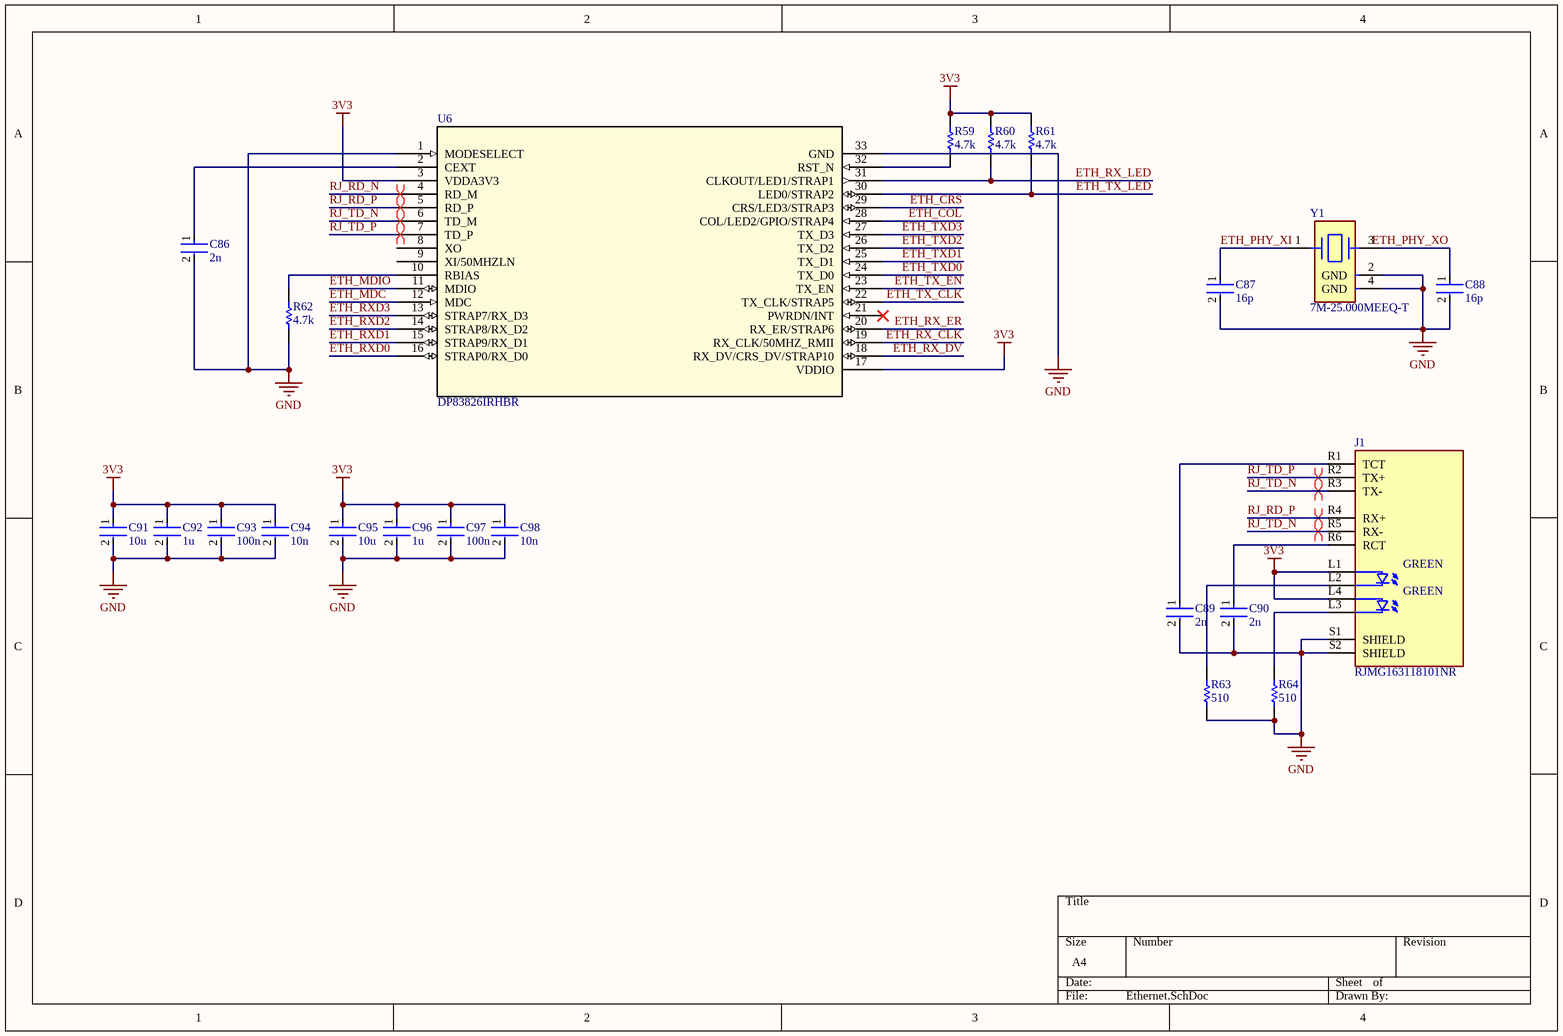
[diagram p6: Ethernet.SchDoc]

### Parts
C86  2n  [FP-C0603C-CF-MFG]
C87  16p  [FP-C0603C-CF-MFG]
C88  16p  [FP-C0603C-CF-MFG]
C89  2n  [FP-C0603C-CF-MFG]
C90  2n  [FP-C0603C-CF-MFG]
C91  10u  [FP-CC0805-0_85-MFG]
C92  1u  [FP-CC0805-0_85-MFG]
C93  100n  [FP-C0603C-CF-MFG]
C94  10n  [FP-C0603C-CF-MFG]
C95  10u  [FP-CC0805-0_85-MFG]
C96  1u  [FP-CC0805-0_85-MFG]
C97  100n  [FP-C0603C-CF-MFG]
C98  10n  [FP-C0603C-CF-MFG]
J1  RJMG163118101NR  [AMPHENOL_RJMG163118101NR]
R59  4.7k  [RESC1609X50X30NL8T20]
R60  4.7k  [RESC1609X50X30NL8T20]
R61  4.7k  [RESC1609X50X30NL8T20]
R62  4.7k  [RESC1609X50X30NL8T20]
R63  510  [RESC1609X50X30NL8T20]
R64  510  [RESC1609X50X30NL8T20]
U6  DP83826IRHBR  [VQFN32_RHB_TEX]
Y1  7M-25.000MEEQ-T  [FP-7M-MFG]

### Nets
3V3: C91.1 C92.1 C93.1 C94.1 C95.1 C96.1 C97.1 C98.1 J1.L1(LED1+) J1.L4(LED2+) R59.2 R60.2 R61.2 U6.3(VDDA3V3) U6.17(VDDIO)
GND: C86.2 C87.2 C88.2 C89.2 C90.2 C91.2 C92.2 C93.2 C94.2 C95.2 C96.2 C97.2 C98.2 J1.S1(SHIELD) J1.S2(SHIELD) R62.1 R63.1 R64.1 U6.1(MODESELECT) U6.33(GND) Y1.2(GND) Y1.4(GND)
ETH_COL: U6.28(COL/LED2/GPIO/STRAP4)
ETH_CRS: U6.29(CRS/LED3/STRAP3)
ETH_MDC: U6.12(MDC)
ETH_MDIO: U6.11(MDIO)
ETH_PHY_XI: C87.1 Y1.1
ETH_PHY_XO: C88.1 Y1.3
ETH_RX_CLK: U6.19(RX_CLK/50MHZ_RMII)
ETH_RX_DV: U6.18(RX_DV/CRS_DV/STRAP10)
ETH_RX_ER: U6.20(RX_ER/STRAP6)
ETH_RX_LED: R60.1 U6.31(CLKOUT/LED1/STRAP1)
ETH_RXD0: U6.16(STRAP0/RX_D0)
ETH_RXD1: U6.15(STRAP9/RX_D1)
ETH_RXD2: U6.14(STRAP8/RX_D2)
ETH_RXD3: U6.13(STRAP7/RX_D3)
ETH_TX_CLK: U6.22(TX_CLK/STRAP5)
ETH_TX_EN: U6.23(TX_EN)
ETH_TX_LED: R61.1 U6.30(LED0/STRAP2)
ETH_TXD0: U6.24(TX_D0)
ETH_TXD1: U6.25(TX_D1)
ETH_TXD2: U6.26(TX_D2)
ETH_TXD3: U6.27(TX_D3)
RJ_RD_N: U6.4(RD_M)
RJ_RD_P: J1.R4(RX+) U6.5(RD_P)
RJ_TD_N: J1.R3(TX-) J1.R5(RX-) U6.6(TD_M)
RJ_TD_P: J1.R2(TX+) U6.7(TD_P)
NetC86_1: C86.1 U6.2(CEXT)
NetC89_1: C89.1 J1.R1(TCT)
NetC90_1: C90.1 J1.R6(RCT)
NetJ1_L2: J1.L2(LED1-) R63.2
NetJ1_L3: J1.L3(LED2-) R64.2
NetR59_1: R59.1 U6.32(RST_N)
NetR62_2: R62.2 U6.10(RBIAS)

Not connected (* = marked no-connect by the designer): U6 8(XO) 9(XI/50MHZLN) 21(PWRDN/INT)*

### Layout directives
differential pair: RJ_RD_N, RJ_RD_P, RJ_TD_N, RJ_TD_P

### Notes on the sheet
- (in symbol RJMG163118101NR) GREEN

### Library data of the parts
C86-C90 C93 C94 C97 C98 = CMP-2006-03061-2: as C1 on sheet Power; Temperature: -55°C to +125°C; RoHS: TRUE; Temperature Range High: +125°C; Lead Free: Yes; Octopart: https://octopart.com/c0603c104k5ractu-kemet-139244; Digikey Description: CAP CER 0.1UF 50V X7R 0603; Category: Cap; Package: C0603C-CF; ComponentLink2Description: Datasheet; Temperature Range Low: -55°C; Device Class L1: Passive Components; Voltage Rating: 50 V; Automotive: Yes; Device Class L3: Ceramic Capacitors; ComponentLink2URL: https://api.kemet.com/component-edge/download/datasheet/C0603C100J5GACAUTO.pdf; Capacitance: 0.10 μF; Device Class L2: Capacitors; Temperature Characteristic: X7R; Height: 0.87mm
C91 C92 C95 C96 = CMP-2100-03606-3: as C52 on sheet DDR3; Device Class L1: Passive Components; ComponentLink2Description: Datasheet; Package: CC0805-0.85; Digikey Description: CAP CER 0.1UF 50V X7R 0805; Device Class L3: Ceramic Capacitors; Temperature: -30°C to +85°C; Temperature Characteristic: X7R; Voltage Rating: 50 V; Height: 0.95mm; RoHS: TRUE; Ipc Land Pattern Name: CAPC200125X85; Device Class L2: Capacitors; Category: Cap; Temperature Range Low: -30°C; Temperature Range High: +85°C; Mouser Description: Multilayer Ceramic Capacitors MLCC - SMD/SMT 100nF 50V X7R 10%; Footprint Url: http://www.yageo.com/exep/pages/download/literatures/UPY-C_GEN_24.pdf; Automotive: No; Octopart: https://octopart.com/cc0805krx7r9bb104-yageo-192993; Lead Free: Yes; ComponentLink2URL: http://www.yageo.com/documents/recent/UPY-GPHC_Y5V_6.3V-to-50V_8.pdf
R59-R64 = CMP-1666-00005-4: as R1 on sheet Power; Max Operating Temperature: 155 degC; PackageDescription: 2-Pin Surface Mount Device, Body 1.575 x 0.85 mm; ComponentLink1Description: Manufacturer URL; RoHSCompliant: true; PackageReference: 0603; REACH SVHC: Unknown; Length: 1.55 mm; DatasheetVersion: 06/2012; Packaging: Tape and Reel; Min Operating Temperature: -55 degC; Mounting Technology: Surface Mount; ComponentLink2URL: https://datasheet.ciiva.com/11809/0900766b80d98afc-11809037.pdf; Height: 0.45 mm; ComponentLink2Description: Datasheet; Package Quantity: 5000; ComponentLink1URL: http://www.vishay.com/
U6 = DP83826IRHBR: No Description Available; Mfr_Name: Texas Instruments; RefDes: RefDes; Type: Type
Y1 = CMP-18717-000310-1: as Y2 on sheet MicroSD; Package Quantity: 3000; Frequency: 25MHz; Width: 0.098inch; Depth: 2.5mm; Series: 7M; Case/Package: SMD/SMT; Min Operating Temperature: -20°C; Frequency Stability: 10ppm; Termination: SMD/SMT; Max Operating Temperature: 70°C; REACH SVHC: No SVHC; Length: 3.2mm; Number of Pins: 4; Frequency Tolerance: 10ppm; Mount: Surface Mount; Tolerance: 10ppm; Height: 0.031inch; Load Capacitance: 10pF; Packaging: Tape and Reel
J1 = RJMG163118101NR: Price: None; Availability: Unavailable; Value: *; MP: RJMG163118101NR; Package: None

## Nets that join several sheets
1V2: Power (C7.1 L3.1 R5.1), STM32 VDD VSS (36 pins), STM32 Decoupling (15 pins)
1V35: Power (C8.1 L4.1 R6.1), DDR3 (29 pins), STM32 VDD VSS (11 pins), STM32 Decoupling (6 pins)
3V3: Power (C5.1 L1.2 R1.1), DDR3 (U1.N1 U1.N2 U1.T15), STM32 VDD VSS (23 pins), STM32 Decoupling (17 pins), MicroSD (13 pins), eMMC (42 pins), Ethernet (15 pins)
GND: Power (23 pins), DDR3 (42 pins), STM32 VDD VSS (101 pins), STM32 Decoupling (38 pins), MicroSD (15 pins), eMMC (31 pins), Ethernet (22 pins)
ETH_COL: MicroSD (U1.P3), Ethernet (U6.28)
ETH_CRS: MicroSD (U1.R3), Ethernet (U6.29)
ETH_MDC: MicroSD (U1.V2), Ethernet (U6.12)
ETH_MDIO: MicroSD (U1.W2), Ethernet (U6.11)
ETH_RX_CLK: MicroSD (U1.U4), Ethernet (U6.19)
ETH_RX_DV: MicroSD (U1.T6), Ethernet (U6.18)
ETH_RX_ER: MicroSD (U1.W5), Ethernet (U6.20)
ETH_RXD0: MicroSD (U1.W4), Ethernet (U6.16)
ETH_RXD1: MicroSD (U1.V4), Ethernet (U6.15)
ETH_RXD2: MicroSD (U1.W3), Ethernet (U6.14)
ETH_RXD3: MicroSD (U1.V3), Ethernet (U6.13)
ETH_TX_CLK: MicroSD (U1.T3), Ethernet (U6.22)
ETH_TX_EN: MicroSD (U1.V1), Ethernet (U6.23)
ETH_TXD0: MicroSD (U1.U2), Ethernet (U6.24)
ETH_TXD1: MicroSD (U1.T9), Ethernet (U6.25)
ETH_TXD2: MicroSD (U1.T2), Ethernet (U6.26)
ETH_TXD3: MicroSD (U1.T1), Ethernet (U6.27)
SDIO2_CK: MicroSD (U1.A5), eMMC (R58.2 U5.P6)
SDIO2_CMD: MicroSD (U1.A6), eMMC (R57.2 U5.P5)
SDIO2_D0: MicroSD (U1.C9), eMMC (R48.2 U5.K2)
SDIO2_D1: MicroSD (U1.A8), eMMC (R49.2 U5.N2)
SDIO2_D2: MicroSD (U1.A7), eMMC (R51.2 U5.K3)
SDIO2_D3: MicroSD (U1.B9), eMMC (R52.2 U5.N3)
SDIO2_D4: MicroSD (U1.B8), eMMC (R53.2 U5.N8)
SDIO2_D5: MicroSD (U1.C7), eMMC (R54.2 U5.K8)
SDIO2_D6: MicroSD (U1.B7), eMMC (R55.2 U5.N9)
SDIO2_D7: MicroSD (U1.A9), eMMC (R56.2 U5.K9)